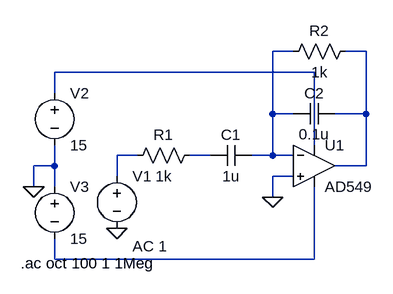
[diagram p0: schematic BandPassFilter.asc]
BandPassFilter.asc, the LTspice schematic file:
Version 4
SHEET 1 880 680
WIRE 176 0 144 0
WIRE 288 0 256 0
WIRE 208 32 -192 32
WIRE -192 64 -192 32
WIRE 144 96 144 0
WIRE 176 96 144 96
WIRE 288 96 288 0
WIRE 288 96 240 96
WIRE 208 144 208 32
WIRE -64 160 -96 160
WIRE 48 160 16 160
WIRE 144 160 144 96
WIRE 144 160 112 160
WIRE 176 160 144 160
WIRE -192 176 -192 144
WIRE -192 176 -224 176
WIRE 288 176 288 96
WIRE 288 176 240 176
WIRE -96 192 -96 160
WIRE 176 192 144 192
WIRE -224 208 -224 176
WIRE -192 208 -192 176
WIRE 144 224 144 192
WIRE -192 320 -192 288
WIRE 208 320 208 208
WIRE 208 320 -192 320
FLAG -224 208 0
FLAG -96 272 0
FLAG 144 224 0
SYMBOL Opamps\\AD549 208 112 R0
SYMATTR InstName U1
SYMBOL res 32 144 R90
WINDOW 0 0 56 VBottom 2
WINDOW 3 32 56 VTop 2
SYMATTR InstName R1
SYMATTR Value 1k
SYMBOL res 272 -16 R90
WINDOW 0 0 56 VBottom 2
WINDOW 3 32 56 VTop 2
SYMATTR InstName R2
SYMATTR Value 1k
SYMBOL cap 112 144 R90
WINDOW 0 0 32 VBottom 2
WINDOW 3 32 32 VTop 2
SYMATTR InstName C1
SYMATTR Value 1u
SYMBOL cap 240 80 R90
WINDOW 0 0 32 VBottom 2
WINDOW 3 32 32 VTop 2
SYMATTR InstName C2
SYMATTR Value 0.1u
SYMBOL voltage -96 176 R0
WINDOW 123 24 124 Left 2
WINDOW 39 0 0 Left 0
SYMATTR InstName V1
SYMATTR Value ""
SYMATTR Value2 AC 1
SYMBOL voltage -192 48 R0
WINDOW 123 0 0 Left 0
WINDOW 39 0 0 Left 0
SYMATTR InstName V2
SYMATTR Value 15
SYMBOL voltage -192 192 R0
WINDOW 123 0 0 Left 0
WINDOW 39 0 0 Left 0
SYMATTR InstName V3
SYMATTR Value 15
TEXT -244 326 Left 2 !.ac oct 100 1 1Meg

The netlist it stands for:
* BandPassFilter.asc
XU1 0 N001 N003 N006 N002 AD549  ; pins In+ In- V+ V- OUT
R1 N005 N004 1k
R2 N002 N001 1k
C1 N001 N005 1u
C2 N002 N001 0.1u
V1 N004 0 AC 1
V2 N003 0 15
V3 0 N006 15
.ac oct 100 1 1Meg
.backanno
.end